# EAGLE schematic V-00321-00 (EAGLE 7.2.0)
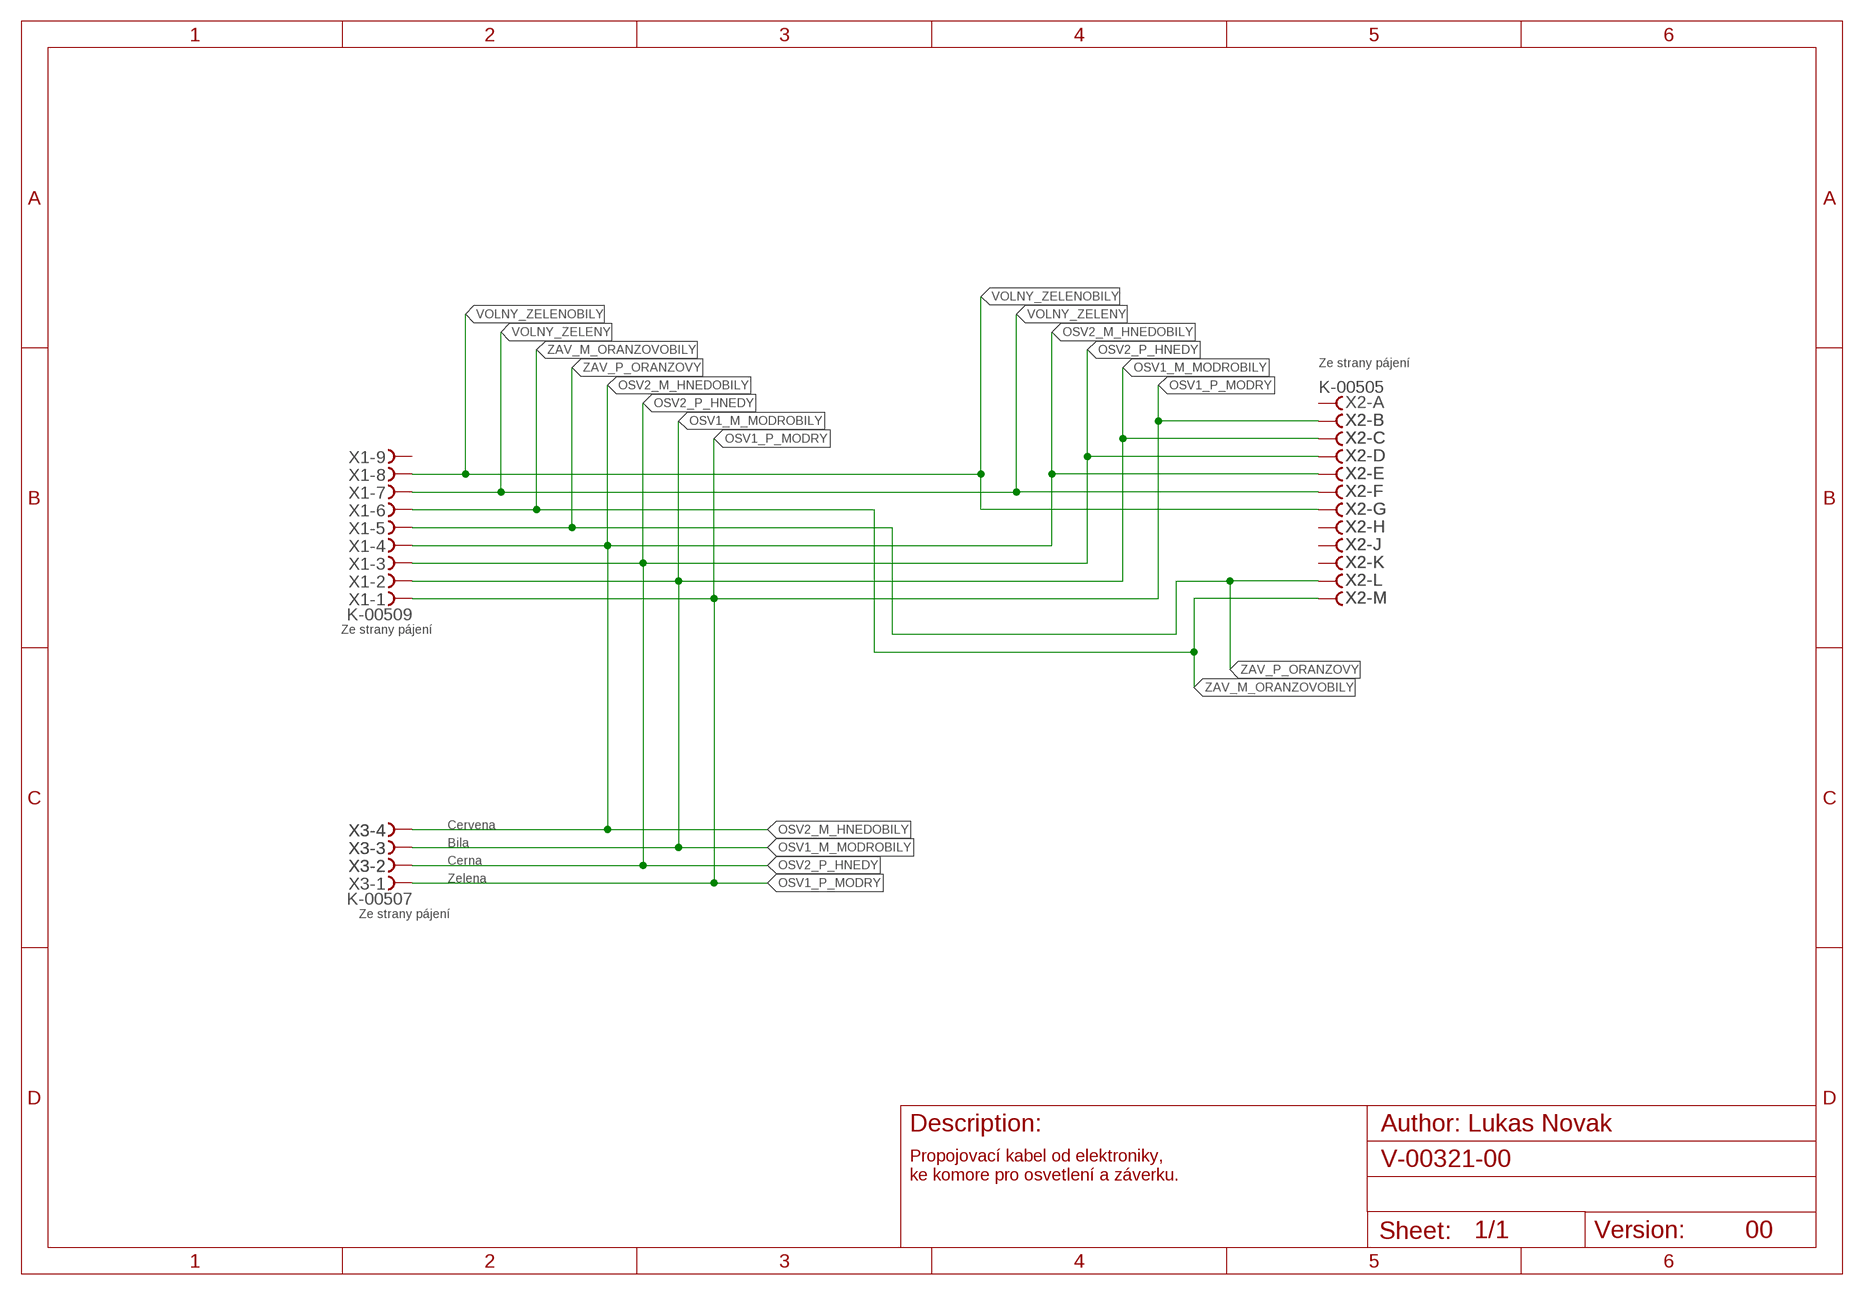
[diagram p0: schematic, sheet 1]

## Parts
X1  K-00509  D-SUB9-H2M09ST  [H2M09ST]
X2  K-00505  LU12MP  [LU12MP]
X3  K-00507  LE4MP  [LE4MP]

## Nets
OSV1_M_MODROBILY: X1.2 X2.C X3.3
OSV1_P_MODRY: X1.1 X2.B X3.1
OSV2_M_HNEDOBILY: X1.4 X2.E X3.4
OSV2_P_HNEDY: X1.3 X2.D X3.2
VOLNY_ZELENOBILY: X1.8 X2.G
VOLNY_ZELENY: X1.7 X2.F
ZAV_M_ORANZOVOBILY: X1.6 X2.M
ZAV_P_ORANZOVY: X1.5 X2.L
Unconnected: X1.9 X2.A X2.H X2.J X2.K

## Notes on the sheet
- Ze strany pájení
- Ze strany pájení
- Cervena
- Bila
- Cerna
- Zelena
- Ze strany pájení
- Propojovací kabel od elektroniky,
  ke komore pro osvetlení a záverku.
- 00

## Library data of the parts
X1 = con-thomas-betts:D-SUB9-: D-Subminiatur Connector Source: Electronioc Interconnects European Edition 1998; OC_FARNELL: unknown; OC_NEWARK: unknown
X2 = Kabely:LU12MP; LU: 12-Pin
X3 = Kabely:LE4MP